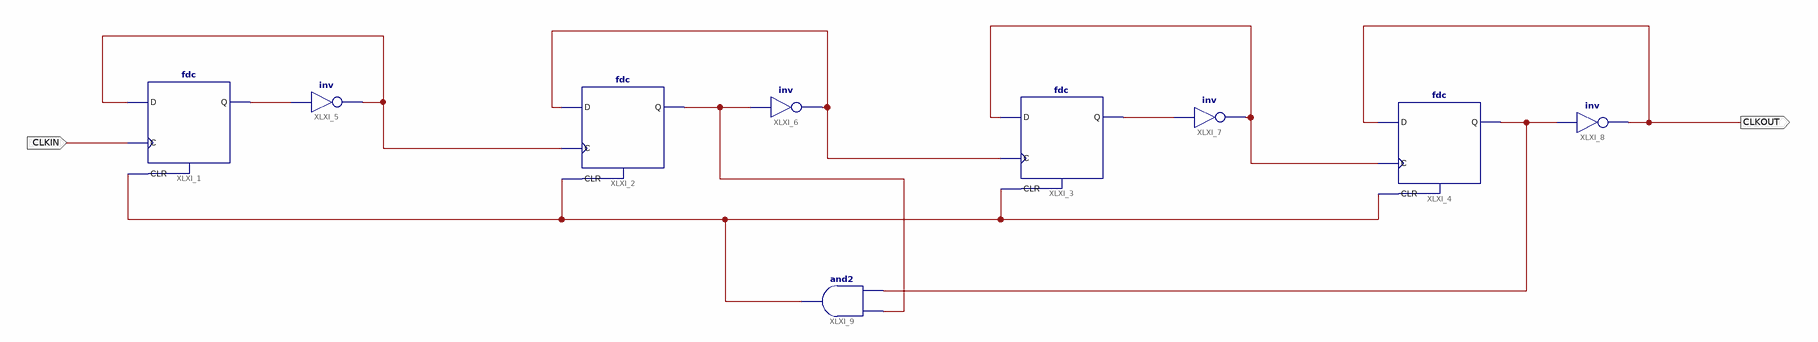
[diagram p0: schematic sheet 1]
// Xilinx ISE schematic DIV10Hz.sch (spartan6) as structural Verilog: 9 symbols, 2 ports
module DIV10Hz (
  input  CLKIN,
  output CLKOUT
);

  wire XLXN_1, XLXN_2, XLXN_3, XLXN_5, XLXN_7, XLXN_10, XLXN_12, XLXN_19;

  fdc XLXI_1 (.C(CLKIN), .CLR(XLXN_19), .D(XLXN_12), .Q(XLXN_10));
  fdc XLXI_2 (.C(XLXN_12), .CLR(XLXN_19), .D(XLXN_5), .Q(XLXN_1));
  fdc XLXI_3 (.C(XLXN_5), .CLR(XLXN_19), .D(XLXN_7), .Q(XLXN_2));
  fdc XLXI_4 (.C(XLXN_7), .CLR(XLXN_19), .D(CLKOUT), .Q(XLXN_3));
  not XLXI_5 (XLXN_12, XLXN_10);
  not XLXI_6 (XLXN_5, XLXN_1);
  not XLXI_7 (XLXN_7, XLXN_2);
  not XLXI_8 (CLKOUT, XLXN_3);
  and XLXI_9 (XLXN_19, XLXN_3, XLXN_1);
endmodule
